# Altium schematic sheet AMP PROTECTION.SchDoc: AMP
size A3; CheckedBy: Alain.Zhu; CompanyName: TYMPHANY; DrawnBy: Yetta.He; Organization: PABU-BL3; Address1: 11F,block A, CEC building,; Address2: No.2070 Shennan Zhong road,; Address3: Huaqiang North, Futian District,; Address4: Shenzhen,  Guang Dong, P.R.C 518000; DocumentNumber: 8; Revision: 1.0.0; SheetNumber: 8; SheetTotal: 8; Size: A3; PCB By: Yetta.He; Status: DP1.1
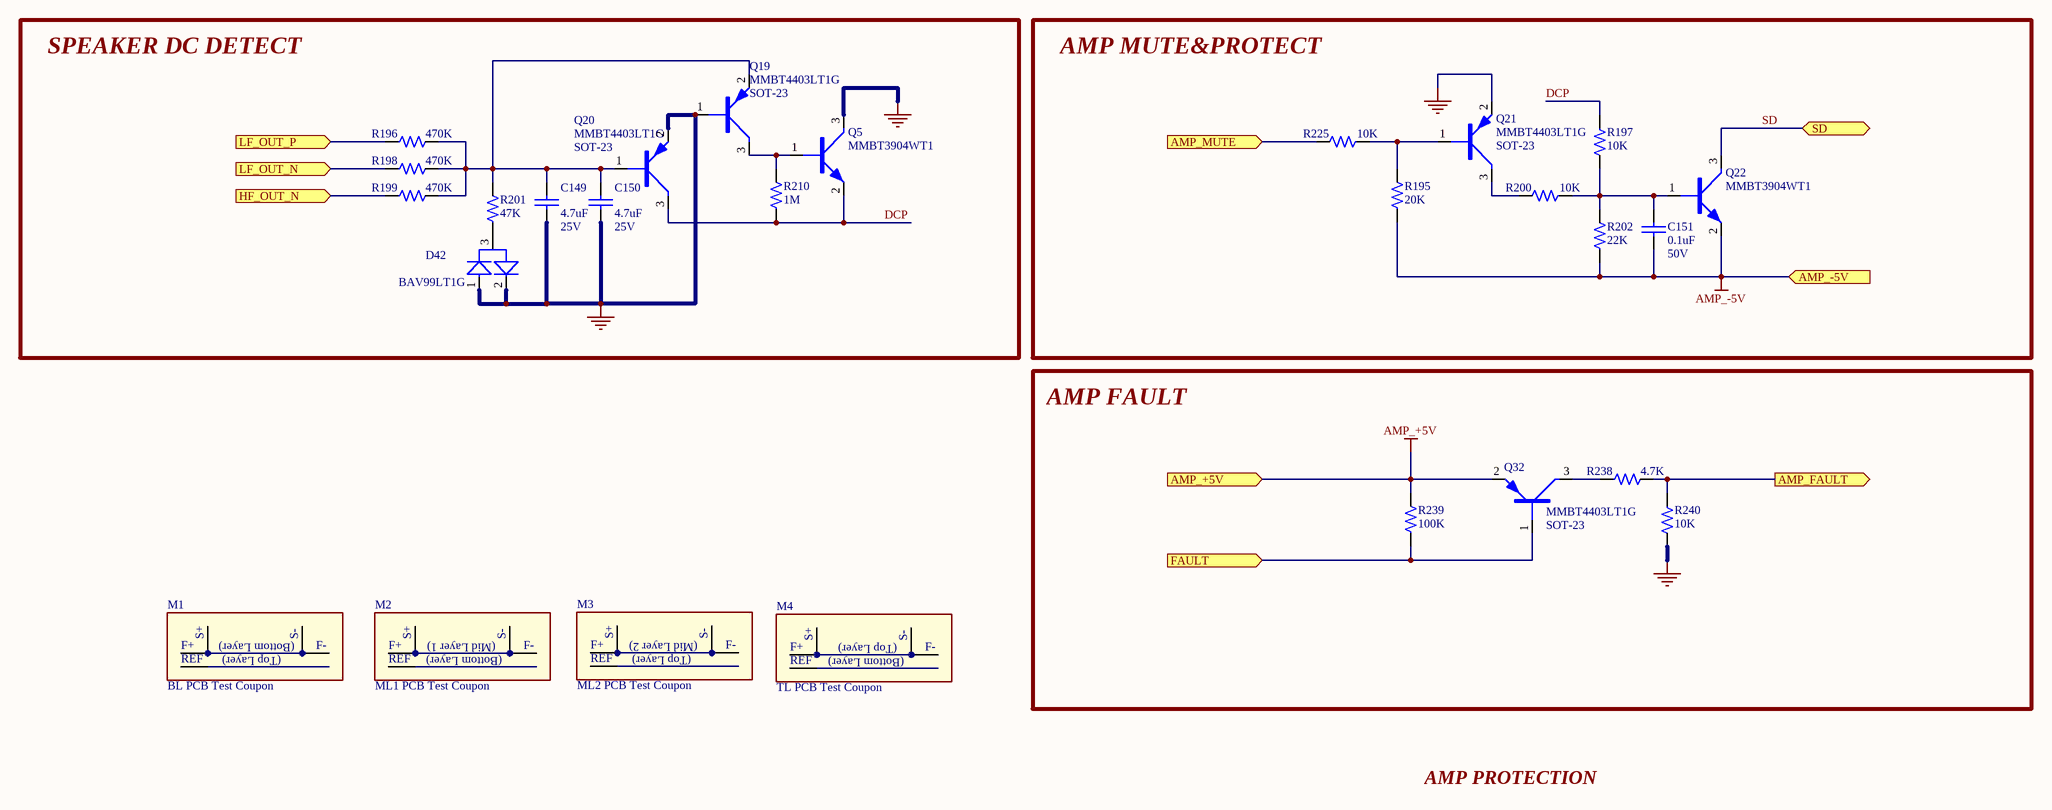
[diagram p0: AMP PROTECTION.SchDoc]

## Parts
C149  value 4.7uF  Voltage: 25V  [CAPC0603-RW]  (hidden comment: T542024757408)
C150  value 4.7uF  Voltage: 25V  [CAPC0603-RW]  (hidden comment: T542024757408)
C151  value 0.1uF  Voltage: 50V  [CAPC0603-RW]  (hidden comment: PXL456470-1040)
D42  RCD100099-0010  [SOT23-132-RW]  (value not drawn)
M1  Text Field1: BL PCB Test Coupon  [M_BL_TL_PCB_Test_Coupon]  (hidden comment: Test Coupon)
M2  Text Field1: ML1 PCB Test Coupon  [M_ML1_BL_PCB_Test_Coupon]  (hidden comment: Test Coupon)
M3  Text Field1: ML2 PCB Test Coupon  [M_ML2_TL_PCB_Test_Coupon]  (hidden comment: Test Coupon)
M4  Text Field1: TL PCB Test Coupon  [M_TL_BL_PCB_Test_Coupon]  (hidden comment: Test Coupon)
Q5  T581003992440  [SOT323(SC-70)-R]  (value not drawn)
Q19  Package: SOT-23  [SOT23-132-RW]  (hidden comment: T582003100440)
Q20  Package: SOT-23  [SOT23-132-RW]  (hidden comment: T582003100440)
Q21  Package: SOT-23  [SOT23-132-RW]  (hidden comment: T582003100440)
Q22  T581003992440  [SOT323(SC-70)-R]  (value not drawn)
Q32  Package: SOT-23  [SOT23-132-RW]  (hidden comment: T582003100440)
R195  value 20K  [0603-RW]  (hidden comment: QCF011030-2002)
R196  value 470K  [0603-RW]  (hidden comment: QCF011030-4703)
R197  value 10K  [0603-RW]  (hidden comment: QCF011030-1002)
R198  value 470K  [0603-RW]  (hidden comment: QCF011030-4703)
R199  value 470K  [0603-RW]  (hidden comment: QCF011030-4703)
R200  value 10K  [0603-RW]  (hidden comment: QCF011030-1002)
R201  value 47K  [0603-RW]  (hidden comment: QCF011030-4702)
R202  value 22K  [0603-RW]  (hidden comment: QCF011030-2202)
R210  value 1M  [0603-RW]  (hidden comment: QCF011030-1004)
R225  value 10K  [0603-RW]  (hidden comment: QCF011030-1002)
R238  value 4.7K  [0603-RW]  (hidden comment: QCF011030-4701)
R239  value 100K  [0603-RW]  (hidden comment: QCF011030-1003)
R240  value 10K  [0603-RW]  (hidden comment: QCF011030-1002)

## Blocks framed on the sheet
SPEAKER DC DETECT: C149 C150 D42 Q5 Q19 Q20 R196 R198 R199 R201 R210
AMP MUTE&PROTECT: C151 Q21 Q22 R195 R197 R200 R202 R225
AMP FAULT: Q32 R238-R240

## Ports
AMP_+5V (in), AMP_-5V (in), AMP_FAULT (out), AMP_MUTE (in), FAULT (in), HF_OUT_N (in), LF_OUT_N (in), LF_OUT_P (in), SD (bidir)

## Nets
AMP_+5V: Q32.2(E) R239.2 ; port AMP_+5V
AMP_-5V: C151.2 Q22.2(E) R195.1 R202.1 ; port AMP_-5V
GND: C149.2 C150.2 D42.1(A) D42.2(A) Q5.3(C) Q19.1(B) Q20.2(E) Q21.2(E) R240.2
AMP_FAULT: R238.2 R240.1 ; port AMP_FAULT
AMP_MUTE: R225.2 ; port AMP_MUTE
DCP: Q5.2(E) Q20.3(C) R197.1 R210.1
FAULT: Q32.1(B) R239.1 ; port FAULT
HF_OUT_N: R199.1 ; port HF_OUT_N
LF_OUT_N: R198.1 ; port LF_OUT_N
LF_OUT_P: R196.1 ; port LF_OUT_P
SD: Q22.3(C) ; port SD
NetC149_1: C149.1 C150.1 Q19.2(E) Q20.1(B) R196.2 R198.2 R199.2 R201.2
NetC151_1: C151.1 Q22.1(B) R197.2 R200.1 R202.2
NetD42_3: D42.3(K) R201.1
NetQ5_1: Q5.1(B) Q19.3(C) R210.2
NetQ21_1: Q21.1(B) R195.2 R225.1
NetQ21_3: Q21.3(C) R200.2
NetQ32_3: Q32.3(C) R238.1

## Notes on the sheet
- AMP PROTECTION
- Client
- Description of change/Notes:
- REV
- Premium Loudspeakers
- (Hui Zhou) Co. Ltd., Shenzhen Branch
- Tel: +86 755-339-121-88
- Board:
- Status:
- Revision:
- Product:
- Approved By:
- Grand Prix_
- Drawn By:
- Modified By:
- Checked By:
- PCB By:
- Size:
- www.tymphany.com <http://www.tymphany.com>
- Date:
- Time:
- Sheet
- of
- (in symbol M_BL_TL_PCB_Test_Coupon) S+; (Bottom Layer); S-; F+; (Top Layer); F-; REF
- (in symbol M_ML1_BL_PCB_Test_Coupon) S+; (Mid Layer 1); S-; F+; (Bottom Layer); F-; REF
- (in symbol M_ML2_TL_PCB_Test_Coupon) S+; (Mid Layer 2); S-; F+; (Top Layer); F-; REF
- (in symbol M_TL_BL_PCB_Test_Coupon) S+; (Top Layer); S-; F+; (Bottom Layer); F-; REF

## Library data of the parts
C149 C150 = CAP0603 4.7uF 25V 10%_X7R_WALSIN: CAP X7R 4.7UF 25V +-10% 0603 WALSIN L; Tolerance: 10%; Type: Capacitor; CREATE_NAME: Nathan; DIP&SMD: SMD; SAP: T542024757408; PACKAGE: CAPC0603; Vendor Name: *; MFG: WALSIN; MFG Part: *; Other: X7R; CREATE_TIME: 13-July-2016; Customer Specific: N/A
C151 = CAP0603 0.1uF 50V 10% - PXL456470-1040: GP CHIP CAP 0.1uF 50V 10% 0603 TYPE X7R; SAP: T542021047508; Vendor Code: 10010262; Vendor Name: 东莞市晴远电子有限公司; Type: Capacitor; DIP&SMD: SMD; PACKAGE: CAPC0603; MFG: *; MFG Part: *; Other: X7R; Tolerance: 10%; Customer Specific: N/A
D42 = BAV99LT1G: SWITC 70V 215MA BAV99LT1G ON SE G; SAP: T572003550122; MFG: ON SEMI; Voltage: 100V; Power: 225MW; Type: DIODE; Vendor Code: *; Vendor Name: *; Current: 215mA; Package: SOT-23; MFG Part: BAV99LT1G
M1 = M_BL_TL_PCB_Test_Coupon: Bottom-Layer PCB Test Coupon (REF plane on Top Layer); Text Field7: (component fabricated on PCB)
M2 = M_ML1_BL_PCB_Test_Coupon: Mid-Layer1 PCB Test Coupon (REF  plane on Bottom Layer); Text Field7: (component fabricated on PCB)
M3 = M_ML2_TL_PCB_Test_Coupon: Mid-Layer2 PCB Test Coupon (REF  plane on Top Layer); Text Field7: (component fabricated on PCB)
M4 = M_TL_BL_PCB_Test_Coupon: Top-Layer PCB Test Coupon (REF  plane on Bottom Layer); Text Field7: (component fabricated on PCB)
Q5 Q22 = MMBT3904WT1: NPN 40V MMBT3904WT1 SC70 ( ON K; CREATE_NAME: Nathan; DIP&SMD: SMD; SAP: T581003992440; MFG: ON; Vendor Code: *; Vendor Name: *; Voltage: *; Type: NPN; CREATE_TIME: 17-Oct-2017; Current: *; Customer Specific: N/A; MFG Part: MMBT3904WT1
Q19-Q21 Q32 = MMBT4403LT1G: PNP -40V MMBT4403LT1G SOT23 ON K; Voltage: 40V; DIP&SMD: SMD; Current: 600mA; CREATE NAME: Nathan; SAP: T582003100440; MFG: ON; Vendor Code: *; Vendor Name: *; Type: PNP; Customer Specific: N/A; MFG Part: MMBT4403LT1G; CREATE TIME: 25-Dec-2018
R195 = RES0603 1/10W 1% 20K OHM: GP CHIP RES. 20K OHM 1/10W 1% 0603; Vendor Code: 10010262; SAP: T502200202399; Vendor Name: 东莞市晴远电子有限公司; DIP&SMD: SMD; Power: 1/10W; MFG Part: *; MFG: *; TOL: 1%; Type: Resistor; PACKAGE: 0603; Customer Specific: N/A
R196 R198 R199 = RES0603 1/10W 1% 470K OHM: CHIP RES. 470K OHM 1/10W 1% 0603; Vendor Code: 10010262; SAP: T502470302399; Vendor Name: 东莞市晴远电子有限公司; DIP&SMD: SMD; Power: 1/10W; MFG Part: *; MFG: *; TOL: 1%; Type: Resistor; PACKAGE: 0603; Customer Specific: N/A
R197 R200 R225 R240 = RES0603 1/10W 1% 10K OHM: GP CHIP RES. 10K OHM 1/10W 1% 0603; Vendor Code: 10010262; SAP: T502100202399; Vendor Name: 东莞市晴远电子有限公司; DIP&SMD: SMD; Power: 1/10W; MFG Part: *; MFG: *; TOL: 1%; Type: Resistor; PACKAGE: 0603; Customer Specific: N/A
R201 = RES0603 1/10W 1% 47K OHM: GP CHIP RES. 47K OHM 1/10W 1% 0603; Vendor Code: 10010262; SAP: T502470202399; Vendor Name: 东莞市晴远电子有限公司; DIP&SMD: SMD; Power: 1/10W; MFG Part: *; MFG: *; TOL: 1%; Type: Resistor; PACKAGE: 0603; Customer Specific: N/A
R202 = RES0603 1/10W 1% 22K OHM: GP CHIP RES. 22K OHM 1/10W 1% 0603; Vendor Code: 10010262; SAP: T502220202399; Vendor Name: 东莞市晴远电子有限公司; DIP&SMD: SMD; Power: 1/10W; MFG Part: *; MFG: *; TOL: 1%; Type: Resistor; PACKAGE: 0603; Customer Specific: N/A
R210 = RES0603 1/10W 1% 1M OHM: GP CHIP RES. 1M OHM 1/10W 1% 0603; Vendor Code: 10010262; SAP: T502100402399; Vendor Name: 东莞市晴远电子有限公司; DIP&SMD: SMD; Power: 1/10W; MFG: *; MFG Part: *; TOL: 1%; Type: Resistor; PACKAGE: 0603; Customer Specific: N/A
R238 = RES0603 1/10W 1% 4.7K OHM: GP CHIP RES. 4.7K OHM 1/10W 1% 0603; Vendor Code: 10010262; SAP: T502470102399; Vendor Name: 东莞市晴远电子有限公司; DIP&SMD: SMD; Power: 1/10W; MFG Part: *; MFG: *; TOL: 1%; Type: Resistor; PACKAGE: 0603; Customer Specific: N/A
R239 = RES0603 1/10W 1% 100K OHM: GP CHIP RES. 100K OHM 1/10W 1% 0603; Vendor Code: 10010262; SAP: T502100302399; Vendor Name: 东莞市晴远电子有限公司; DIP&SMD: SMD; Power: 1/10W; MFG Part: *; MFG: *; TOL: 1%; Type: Resistor; PACKAGE: 0603; Customer Specific: N/A